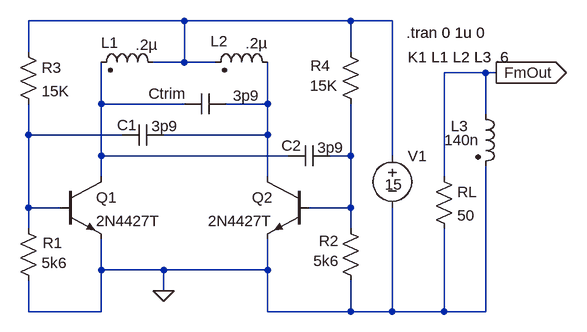
[diagram p0: schematic 3W_Out0.asc]
3W_Out0.asc, the LTspice schematic file:
Version 4
SHEET 1 880 680
WIRE -64 112 -64 64
WIRE -64 240 -64 192
WIRE -64 352 -64 240
WIRE -64 384 -64 352
WIRE -64 512 -64 464
WIRE -16 352 -64 352
WIRE 48 192 48 128
WIRE 48 272 48 192
WIRE 48 304 48 272
WIRE 48 448 48 400
WIRE 48 512 -64 512
WIRE 48 512 48 448
WIRE 80 240 -64 240
WIRE 144 448 48 448
WIRE 144 480 144 448
WIRE 176 64 -64 64
WIRE 176 128 128 128
WIRE 176 128 176 64
WIRE 176 192 48 192
WIRE 224 128 176 128
WIRE 304 192 240 192
WIRE 304 192 304 128
WIRE 304 240 144 240
WIRE 304 240 304 192
WIRE 304 304 304 240
WIRE 304 448 144 448
WIRE 304 448 304 400
WIRE 304 512 304 448
WIRE 336 272 48 272
WIRE 432 64 176 64
WIRE 432 112 432 64
WIRE 432 272 400 272
WIRE 432 272 432 192
WIRE 432 352 368 352
WIRE 432 352 432 272
WIRE 432 384 432 352
WIRE 432 512 304 512
WIRE 432 512 432 464
WIRE 496 64 432 64
WIRE 496 272 496 64
WIRE 496 512 432 512
WIRE 496 512 496 352
WIRE 576 304 576 144
WIRE 576 512 496 512
WIRE 576 512 576 384
WIRE 640 144 576 144
WIRE 640 208 640 144
WIRE 640 512 576 512
WIRE 640 512 640 288
WIRE 656 144 640 144
FLAG 656 144 FmOut
IOPIN 656 144 Out
FLAG 144 480 0
SYMBOL npn2 -16 304 R0
SYMATTR InstName Q1
SYMATTR Value 2N4427T
SYMBOL npn2 368 304 M0
SYMATTR InstName Q2
SYMATTR Value 2N4427T
SYMBOL cap 240 176 R90
WINDOW 0 16 90 VBottom 0
WINDOW 3 -12 -31 VTop 0
SYMATTR InstName Ctrim
SYMATTR Value 3p9
SYMBOL ind2 144 144 M270
WINDOW 0 31 83 VTop 0
WINDOW 3 59 26 VBottom 0
SYMATTR InstName L1
SYMATTR Value .2µ
SYMBOL ind2 320 144 M270
WINDOW 0 33 90 VTop 0
WINDOW 3 61 33 VBottom 0
SYMATTR InstName L2
SYMATTR Value .2µ
SYMBOL res -80 368 R0
WINDOW 0 38 38 Left 0
WINDOW 3 36 69 Left 0
SYMATTR InstName R1
SYMATTR Value 5k6
SYMBOL res 416 368 R0
WINDOW 0 -33 35 Left 0
WINDOW 3 -41 66 Left 0
SYMATTR InstName R2
SYMATTR Value 5k6
SYMBOL res -80 96 R0
SYMATTR InstName R3
SYMATTR Value 15K
SYMBOL res 416 96 R0
WINDOW 0 -46 37 Left 0
WINDOW 3 -47 68 Left 0
SYMATTR InstName R4
SYMATTR Value 15K
SYMBOL ind2 624 192 R0
WINDOW 0 -38 34 Left 0
WINDOW 3 -48 56 Left 0
SYMATTR InstName L3
SYMATTR Value 140n
SYMATTR Type ind
SYMBOL res 560 288 R0
SYMATTR InstName RL
SYMATTR Value 50
SYMBOL cap 144 224 R90
WINDOW 0 16 56 VBottom 0
WINDOW 3 -13 -2 VTop 0
SYMATTR InstName C1
SYMATTR Value 3p9
SYMBOL cap 400 256 R90
WINDOW 0 16 59 VBottom 0
WINDOW 3 -12 -1 VTop 0
SYMATTR InstName C2
SYMATTR Value 3p9
SYMBOL voltage 496 256 R0
WINDOW 3 -11 60 Left 0
WINDOW 123 0 0 Left 0
WINDOW 39 0 0 Left 0
SYMATTR InstName V1
SYMATTR Value 15
TEXT 518 82 Left 0 !.tran 0 1u 0
TEXT 520 120 Left 0 !K1 L1 L2 L3 .6

The netlist it stands for:
* 3W_Out0.asc
Q1 N003 N002 0 0 2N4427T
Q2 N004 N005 0 0 2N4427T
Ctrim N004 N003 3p9
L1 N001 N003 .2µ
L2 N004 N001 .2µ
R1 N002 0 5k6
R2 N005 0 5k6
R3 N001 N002 15K
R4 N001 N005 15K
L3 FmOut 0 140n
RL FmOut 0 50
C1 N004 N002 3p9
C2 N005 N003 3p9
V1 N001 0 15
.model NPN NPN
.model PNP PNP
.lib standard.bjt
.tran 0 1u 0
K1 L1 L2 L3 .6
.backanno
.end